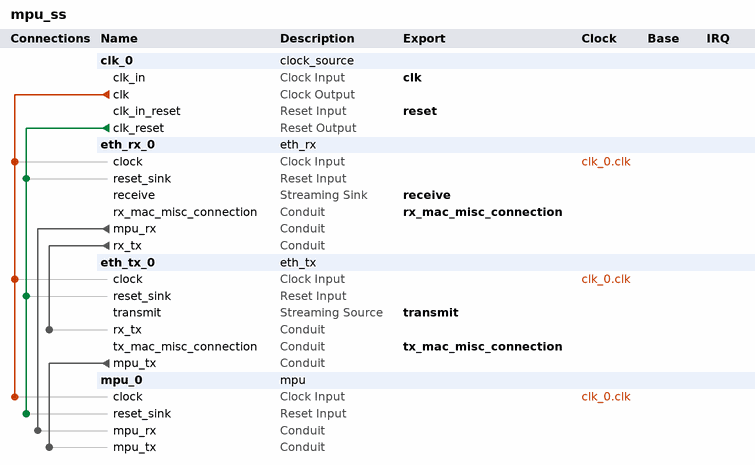
[diagram p0: system contents]
# Platform Designer (Qsys) system mpu_ss, Cyclone 10 LP 10CL025YU256I7G
# Parameters at their usual value, and those the tool derives, are not listed.
package require -exact qsys 18.1
create_system mpu_ss
set_project_property DEVICE_FAMILY {Cyclone 10 LP}
set_project_property DEVICE 10CL025YU256I7G

add_instance clk_0 clock_source 18.1
set_instance_parameter_value clk_0 clockFrequency 12500000
set_instance_parameter_value clk_0 clockFrequencyKnown false

add_instance eth_rx_0 eth_rx 1.0
set_instance_parameter_value eth_rx_0 MMU_SIZE 10

add_instance eth_tx_0 eth_tx 1.0

add_instance mpu_0 mpu 1.0
set_instance_parameter_value mpu_0 ACC_SIZE 24
set_instance_parameter_value mpu_0 FIFO_SIZE 4
set_instance_parameter_value mpu_0 MMU_SIZE 10
set_instance_parameter_value mpu_0 VAR_SIZE 8

# connections
add_connection clk_0.clk eth_rx_0.clock clock
add_connection clk_0.clk eth_tx_0.clock clock
add_connection clk_0.clk mpu_0.clock clock
add_connection clk_0.clk_reset eth_rx_0.reset_sink reset
add_connection clk_0.clk_reset eth_tx_0.reset_sink reset
add_connection clk_0.clk_reset mpu_0.reset_sink reset
add_connection eth_rx_0.mpu_rx mpu_0.mpu_rx conduit
add_connection eth_rx_0.rx_tx eth_tx_0.rx_tx conduit
add_connection eth_tx_0.mpu_tx mpu_0.mpu_tx conduit

# exported interfaces
add_interface clk clock sink
set_interface_property clk EXPORT_OF clk_0.clk_in
add_interface receive avalon_streaming sink
set_interface_property receive EXPORT_OF eth_rx_0.receive
add_interface reset reset sink
set_interface_property reset EXPORT_OF clk_0.clk_in_reset
add_interface rx_mac_misc_connection conduit end
set_interface_property rx_mac_misc_connection EXPORT_OF eth_rx_0.rx_mac_misc_connection
add_interface transmit avalon_streaming source
set_interface_property transmit EXPORT_OF eth_tx_0.transmit
add_interface tx_mac_misc_connection conduit end
set_interface_property tx_mac_misc_connection EXPORT_OF eth_tx_0.tx_mac_misc_connection

set_interconnect_requirement {$system} qsys_mm.clockCrossingAdapter AUTO
set_interconnect_requirement {$system} qsys_mm.enableEccProtection FALSE
set_interconnect_requirement {$system} qsys_mm.insertDefaultSlave FALSE
set_interconnect_requirement {$system} qsys_mm.maxAdditionalLatency 1

save_system mpu_ss.qsys
